# EAGLE design TuringTapeMusic_2 (EAGLE 7.6.0)
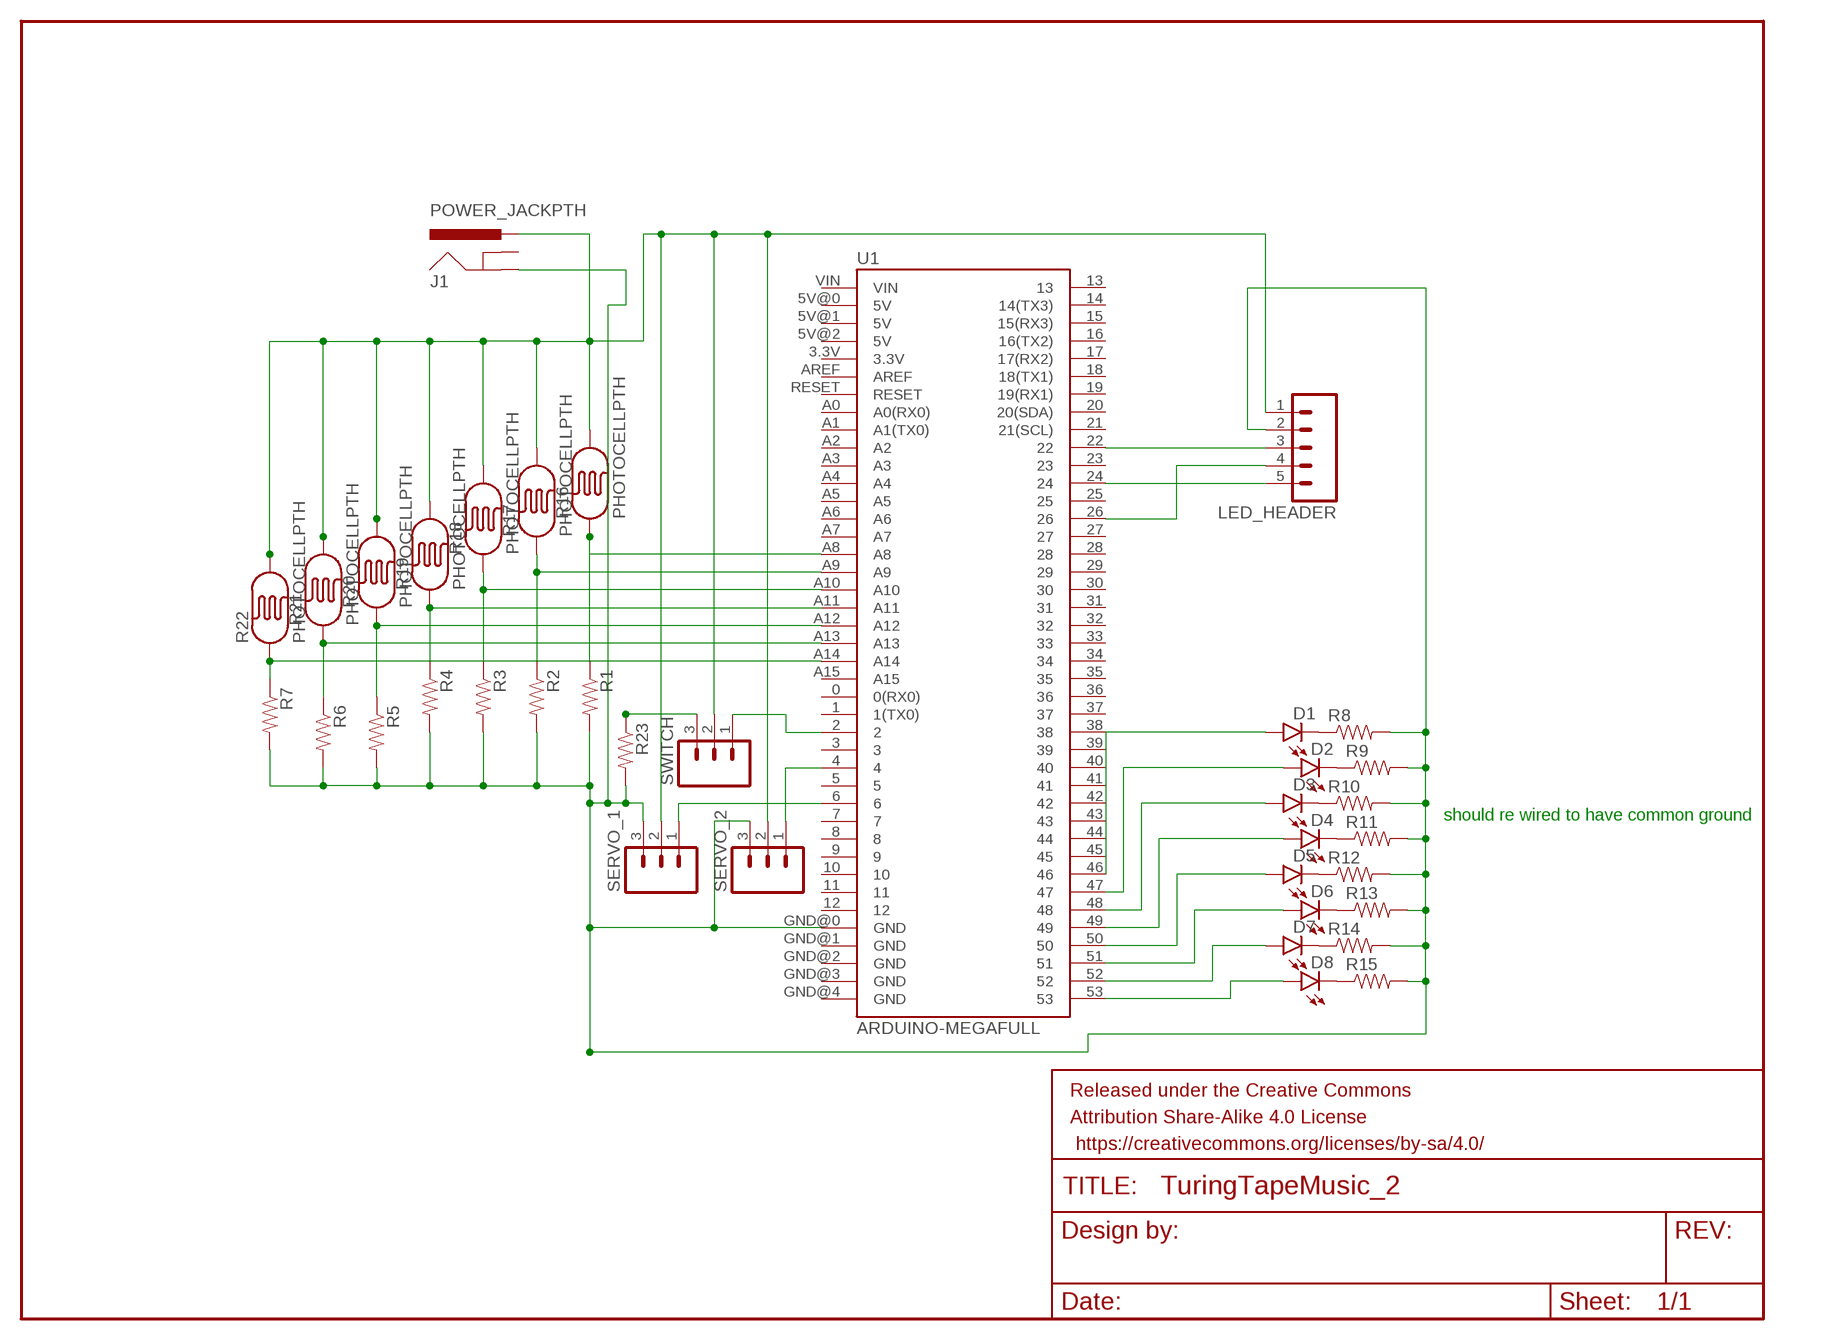
[diagram p0: schematic, sheet 1]

## Parts
D1  LED5MM  [LED5MM]
D2  LED5MM  [LED5MM]
D3  LED5MM  [LED5MM]
D4  LED5MM  [LED5MM]
D5  LED5MM  [LED5MM]
D6  LED5MM  [LED5MM]
D7  LED5MM  [LED5MM]
D8  LED5MM  [LED5MM]
FRAME1  FRAME-LETTER  [CREATIVE_COMMONS]
J1  POWER_JACKPTH  [POWER_JACK_PTH]
LED_HEADER  M05LOCK  [1X05_LOCK]
R1  RESISTORPTH-1/4W  [AXIAL-0.4]
R2  RESISTORPTH-1/4W  [AXIAL-0.4]
R3  RESISTORPTH-1/4W  [AXIAL-0.4]
R4  RESISTORPTH-1/4W  [AXIAL-0.4]
R5  RESISTORPTH-1/4W  [AXIAL-0.4]
R6  RESISTORPTH-1/4W  [AXIAL-0.4]
R7  RESISTORPTH-1/4W  [AXIAL-0.4]
R8  RESISTORPTH-1/4W  [AXIAL-0.4]
R9  RESISTORPTH-1/4W  [AXIAL-0.4]
R10  RESISTORPTH-1/4W  [AXIAL-0.4]
R11  RESISTORPTH-1/4W  [AXIAL-0.4]
R12  RESISTORPTH-1/4W  [AXIAL-0.4]
R13  RESISTORPTH-1/4W  [AXIAL-0.4]
R14  RESISTORPTH-1/4W  [AXIAL-0.4]
R15  RESISTORPTH-1/4W  [AXIAL-0.4]
R16  PHOTOCELLPTH  [PHOTOCELL]
R17  PHOTOCELLPTH  [PHOTOCELL]
R18  PHOTOCELLPTH  [PHOTOCELL]
R19  PHOTOCELLPTH  [PHOTOCELL]
R20  PHOTOCELLPTH  [PHOTOCELL]
R21  PHOTOCELLPTH  [PHOTOCELL]
R22  PHOTOCELLPTH  [PHOTOCELL]
R23  RESISTORPTH-1/4W  [AXIAL-0.4]
SERVO_1  M03LOCK  [1X03_LOCK]
SERVO_2  M03LOCK  [1X03_LOCK]
SWITCH  M03LOCK  [1X03_LOCK]
U1  ARDUINO-MEGAFULL  [ARDUINO_MEGA]

## Nets
N$1: R1.P$1 R16.1 U1.A8
N$2: R2.P$1 R17.1 U1.A9
N$3: R5.P$1 R20.1 U1.A12
N$4: R3.P$1 R18.1 U1.A10
N$5: R6.P$1 R21.1 U1.A13
N$6: R4.P$1 R19.1 U1.A11
N$7: R7.P$1 R22.1 U1.A14
N$8: D1.K(C) R8.P$1
N$9: D2.K(C) R9.P$1
N$10: D3.K(C) R10.P$1
N$11: D4.K(C) R11.P$1
N$12: D5.K(C) R12.P$1
N$13: D6.K(C) R13.P$1
N$14: D7.K(C) R14.P$1
N$15: D8.K(C) R15.P$1
N$16: D1.A U1.46
N$17: D2.A U1.47
N$18: D3.A U1.48
N$19: D4.A U1.49
N$20: D5.A U1.50
N$21: D6.A U1.51
N$22: D7.A U1.52
N$23: D8.A U1.53
N$24: LED_HEADER.5 U1.24
N$25: LED_HEADER.4 U1.26
N$26: LED_HEADER.3 U1.22
N$27: SERVO_2.1 U1.4
N$28: SERVO_1.1 U1.6
N$29: SWITCH.1 U1.2
N$30: R23.P$1 SWITCH.3
N$31: J1.GND LED_HEADER.2 R1.P$2 R2.P$2 R3.P$2 R4.P$2 R5.P$2 R6.P$2 R7.P$2 R8.P$2 R9.P$2 R10.P$2 R11.P$2 R12.P$2 R13.P$2 R14.P$2 R15.P$2 R23.P$2 SERVO_1.3 SERVO_2.3 U1.GND@0(GND)
N$32: J1.PWR LED_HEADER.1 R16.2 R17.2 R18.2 R19.2 R20.2 R21.2 R22.2 SERVO_1.2 SERVO_2.2 SWITCH.2
Unconnected: J1.GNDBREAK U1.0(0(RX0)) U1.1(1(TX0)) U1.3 U1.3.3V U1.5 U1.5V@0(5V) U1.5V@1(5V) U1.5V@2(5V) U1.7 U1.8 U1.9 U1.10 U1.11 U1.12 U1.13 U1.14(14(TX3)) U1.15(15(RX3)) U1.16(16(TX2)) U1.17(17(RX2)) U1.18(18(TX1)) U1.19(19(RX1)) U1.20(20(SDA)) U1.21(21(SCL)) U1.23 U1.25 U1.27 U1.28 U1.29 U1.30 U1.31 U1.32 U1.33 U1.34 U1.35 U1.36 U1.37 U1.38 U1.39 U1.40 U1.41 U1.42 U1.43 U1.44 U1.45 U1.A0(A0(RX0)) U1.A1(A1(TX0)) U1.A2 U1.A3 U1.A4 U1.A5 U1.A6 U1.A7 U1.A15 U1.AREF U1.GND@1(GND) U1.GND@2(GND) U1.GND@3(GND) U1.GND@4(GND) U1.RESET U1.VIN

## Notes on the sheet
- should re wired to have common ground

## Library data of the parts
D1-D8 = SparkFun-LED:LED: LEDs Standard schematic elements and footprints for 5mm, 3mm, 1206, and 0603 sized LEDs. 5mm - Spark Fun Electronics SKU : COM-00529 (and others)
FRAME1 = SparkFun-Aesthetics:FRAME-LETTER: Schematic Frame Standard 8.5x11 US Letter frame
J1 = SparkFun-Connectors:POWER_JACK: Power Jack This is the standard 5.5mm barrel jack for power. The PTH is the most common, proven, reliable, footprint. The Slot footprint only works if the mill layer is transmitted to the PCB fab house so be warned. Mating wall wart : TOL-00298 (and others); PROD_ID: CONN-08197
LED_HEADER = SparkFun-Connectors:M05: Header 5 Standard 5-pin 0.1" header. Use with straight break away headers (SKU : PRT-00116), right angle break away headers (PRT-00553), swiss pins (PRT-00743), machine pins (PRT-00117), and female headers (PRT-00115). Molex polarized connector foot print use with SKU : PRT-08230 with associated crimp pins and housings.
R1-R15 R23 = SparkFun-Passives:RESISTOR: Resistor Basic schematic elements and footprints for 0603, 1206, and PTH resistors.
R16-R22 = SparkFun-Sensors:PHOTOCELL: CdS photoresistor. This is a low cost way to detect light levels. Resistance decreases with more incoming light. SparkFun SKU: SEN-09088
SERVO_1 SERVO_2 SWITCH = SparkFun-Connectors:M03: Header 3 Standard 3-pin 0.1" header. Use with straight break away headers (SKU : PRT-00116), right angle break away headers (PRT-00553), swiss pins (PRT-00743), machine pins (PRT-00117), and female headers (PRT-00115). Molex polarized connector foot print use with SKU : PRT-08232 with associated crimp pins and housings.
U1 = SparkFun-Boards:ARDUINO-MEGA: Arduino Mega board footprint

## Board
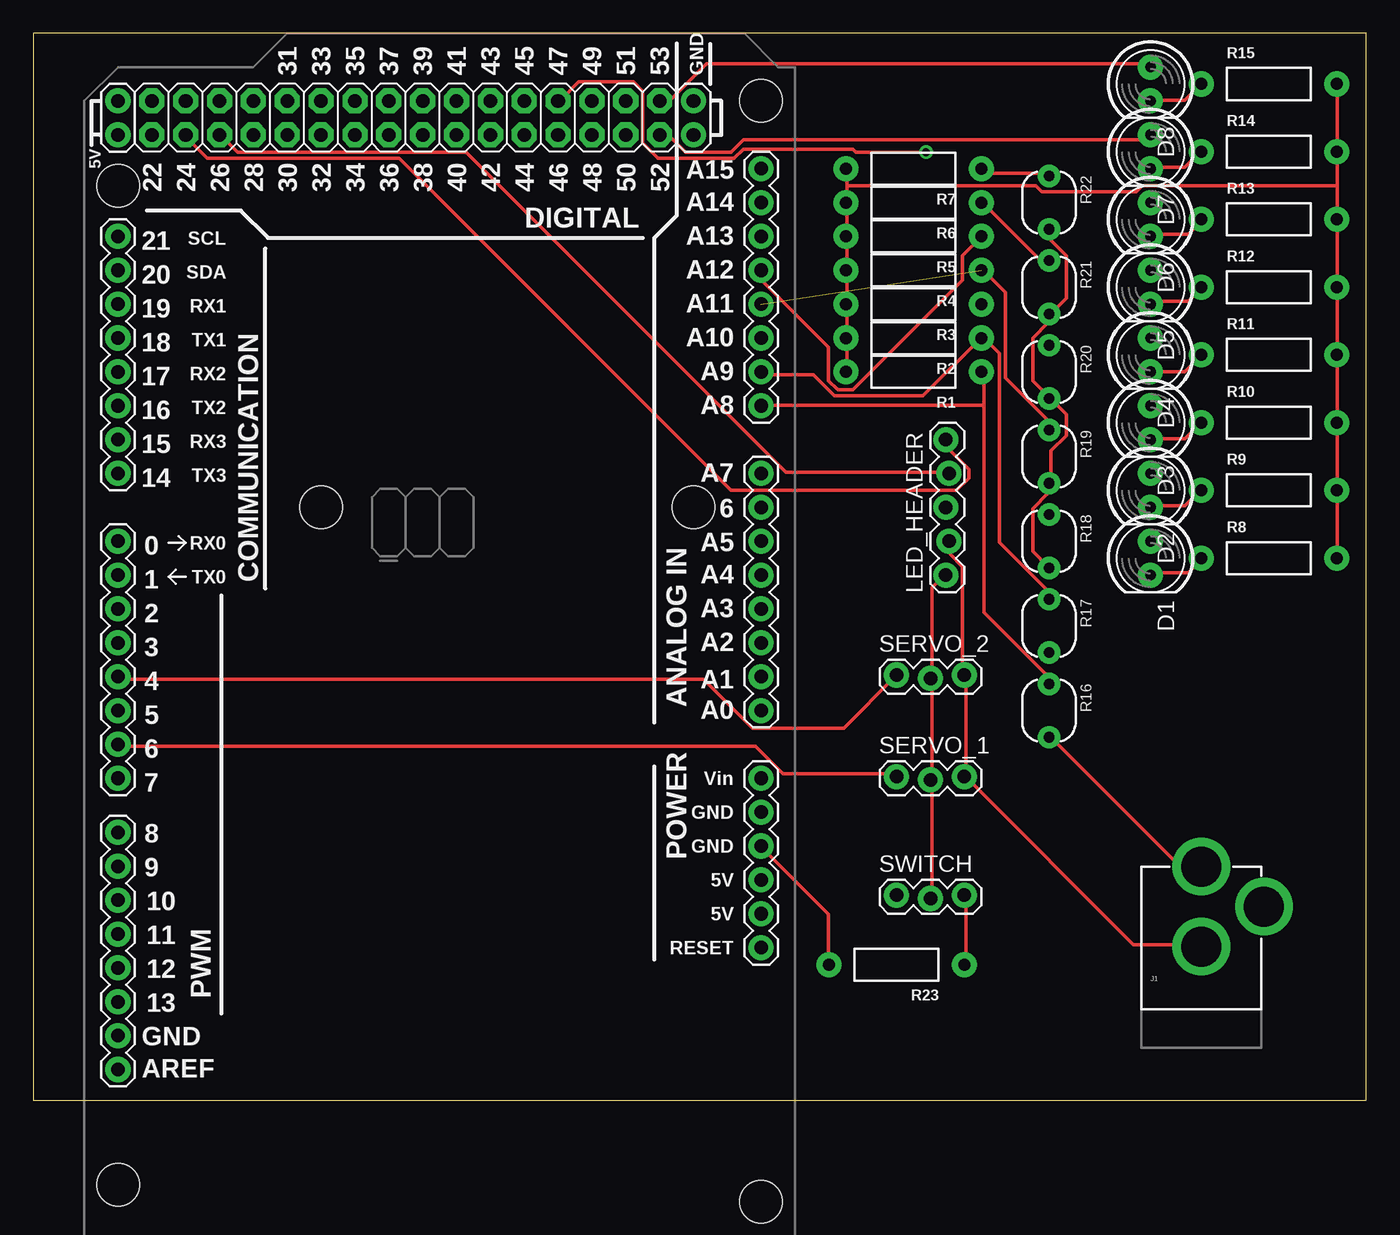
[diagram p1: board, top side]
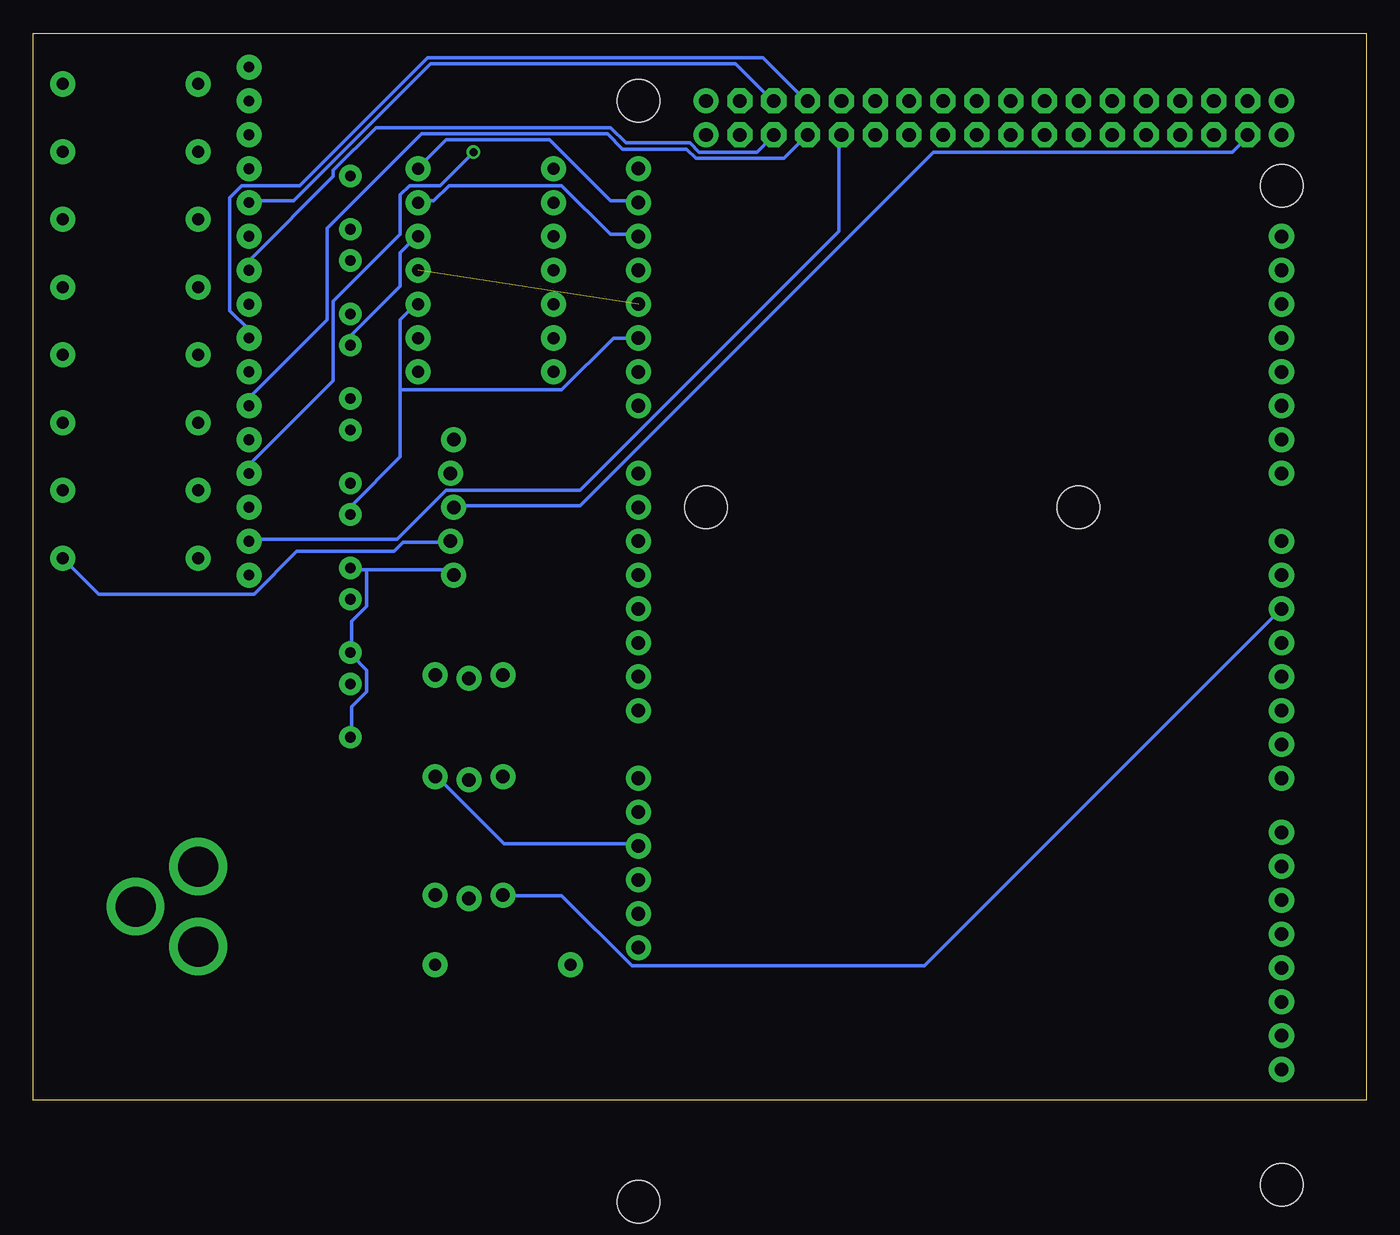
[diagram p2: board, bottom side, seen from below]

Size 100 x 80 mm. Coordinates in mm from the lower left corner, seen from the top.
Outline: 0,0 100,0 100,80 0,80 0,0
Copper layers (1*16): Top 0.035mm / dielectric 1.5mm / Bottom 0.035mm
Design rules "default": minimum track width 10mil, minimum drill 24mil, track to track 8mil, track to pad 8mil, pad to pad 8mil, via to via 8mil, smd to smd 8mil, copper to edge 40mil, drill to drill 8mil, minimum pad ring 10mil, minimum via ring 8mil, stop-mask expansion 4mil, vias tented up to drill 0mil, thermal gap 10mil

### Footprints (pad centres in the part's own frame; a part is rotated, then mirrored left to right if it is on the bottom)
LED5MM = drill 0.813 pad 1.88: A -1.27,0; K 1.27,0
POWER_JACK_PTH = drill 2.997 pad 4.318: GND 0,7.7; GNDBREAK 4.7,10.7; PWR 0,13.7
1X05_LOCK = drill 1.016 pad 1.88: 1 0,0.127; 2 2.54,-0.127; 3 5.08,0.127; 4 7.62,-0.127; 5 10.16,0.127
AXIAL-0.4 = drill 0.9 pad 1.88: P$1 -5.08,0; P$2 5.08,0
PHOTOCELL = drill 0.8 pad 1.676: 1 -2,0; 2 2,0
1X03_LOCK = drill 1.016 pad 1.88: 1 0,0.127; 2 2.54,-0.127; 3 5.08,0.127
ARDUINO_MEGA = drill 1.016 pad 1.88: 0 63.5,50.8; 1 60.96,50.8; 2 58.42,50.8; 3 55.88,50.8; 3.3V 35.56,2.54; 4 53.34,50.8; 5 50.8,50.8; 5V@0 38.1,2.54; 5V@1 93.98,50.8; 5V@2 96.52,50.8; 6 48.26,50.8; 7 45.72,50.8; 8 41.656,50.8; 9 39.116,50.8; 10 36.576,50.8; 11 34.036,50.8; 12 31.496,50.8; 13 28.956,50.8; 14 68.58,50.8; 15 71.12,50.8; 16 73.66,50.8; 17 76.2,50.8; 18 78.74,50.8; 19 81.28,50.8; 20 83.82,50.8; 21 86.36,50.8; A0 50.8,2.54; A1 53.34,2.54; A2 55.88,2.54; A3 58.42,2.54; A4 60.96,2.54; A5 63.5,2.54; A6 66.04,2.54; A7 68.58,2.54; A8 73.66,2.54; A9 76.2,2.54; A10 78.74,2.54; A11 81.28,2.54; A12 83.82,2.54; A13 86.36,2.54; A14 88.9,2.54; A15 91.44,2.54; AREF 23.876,50.8; GND@0 40.64,2.54; GND@1 43.18,2.54; GND@2 93.98,7.62; GND@3 96.52,7.62; GND@4 26.416,50.8; RESET 33.02,2.54; VIN 45.72,2.54 | drill 1.016 pad 1.88 octagon: 22 93.98,48.26; 23 96.52,48.26; 24 93.98,45.72; 25 96.52,45.72; 26 93.98,43.18; 27 96.52,43.18; 28 93.98,40.64; 29 96.52,40.64; 30 93.98,38.1; 31 96.52,38.1; 32 93.98,35.56; 33 96.52,35.56; 34 93.98,33.02; 35 96.52,33.02; 36 93.98,30.48; 37 96.52,30.48; 38 93.98,27.94; 39 96.52,27.94; 40 93.98,25.4; 41 96.52,25.4; 42 93.98,22.86; 43 96.52,22.86; 44 93.98,20.32; 45 96.52,20.32; 46 93.98,17.78; 47 96.52,17.78; 48 93.98,15.24; 49 96.52,15.24; 50 93.98,12.7; 51 96.52,12.7; 52 93.98,10.16; 53 96.52,10.16 | hole 3.2: 15.24,50.8; 13.97,2.54; 66.04,35.56; 66.04,7.62; 90.17,50.8; 96.52,2.54

### Placement (x,y rotation side)
D1  83.82,40.64 270 top
D2  83.82,45.72 270 top
D3  83.82,50.8 270 top
D4  83.82,55.88 270 top
D5  83.82,60.96 270 top
D6  83.82,66.04 270 top
D7  83.82,71.12 270 top
D8  83.82,76.2 270 top
FRAME1  15.24,-43.18 0 top  (outside the outline)
J1  87.63,3.81 0 top
LED_HEADER  68.58,39.37 90 top
R1  66.04,54.61 180 top
R2  66.04,57.15 180 top
R3  66.04,59.69 180 top
R4  66.04,62.23 180 top
R5  66.04,64.77 180 top
R6  66.04,67.31 180 top
R7  66.04,69.85 180 top
R8  92.71,40.64 0 top
R9  92.71,45.72 0 top
R10  92.71,50.8 0 top
R11  92.71,55.88 0 top
R12  92.71,60.96 0 top
R13  92.71,66.04 0 top
R14  92.71,71.12 0 top
R15  92.71,76.2 0 top
R16  76.2,29.21 270 top
R17  76.2,35.56 270 top
R18  76.2,41.91 270 top
R19  76.2,48.26 270 top
R20  76.2,54.61 270 top
R21  76.2,60.96 270 top
R22  76.2,67.31 270 top
R23  64.77,10.16 180 top
SERVO_1  64.77,24.13 0 top
SERVO_2  64.77,31.75 0 top
SWITCH  64.77,15.24 0 top
U1  57.15,-21.59 90 top

### Tracks (layer width: path | path; a pad name or v marks a point on that pad's centre or on a via)
N$1
  Top 0.254: 71.32,52.12 71.32,54.41 R1.P$1 | 71.32,52.12 71.32,36.58 76.12,31.77 76.12,31.32 R16.1 | 71.32,52.12 54.63,52.12 U1.A8
N$2
  Top 0.254: R17.1 76.12,37.72 76.12,38.18 72.47,41.83 72.47,56.01 71.32,57.15 R2.P$1 71.09,57.15 66.75,52.81 60.12,52.81 58.52,54.41 54.63,54.41 U1.A9
N$3
  Top 0.254: U1.A12 54.63,62.18 54.63,61.49 59.66,56.46 59.66,53.95 60.35,53.26 61.49,53.26 69.72,61.49 69.72,63.32 71.09,64.69 R5.P$1
  Bottom 0.254: R20.1 76.12,56.69 76.12,57.38 72.47,61.04 72.47,63.55 71.32,64.69 R5.P$1
N$4
  Bottom 0.254: 72.47,53.26 72.47,58.52 71.32,59.66 R3.P$1 | 72.47,53.26 72.47,48.23 76.12,44.58 76.12,44.12 R18.1 | U1.A10 56.46,57.15 60.35,53.26 72.47,53.26
N$5
  Top 0.254: R21.1 76.12,63.09 75.44,63.09 71.32,67.21 R6.P$1
  Bottom 0.254: U1.A13 54.63,64.92 56.69,64.92 60.35,68.58 68.81,68.58 69.95,67.44 71.09,67.44 R6.P$1
N$6  (1 unrouted)
  Top 0.254: R19.1 76.12,50.29 76.12,50.98 72.92,54.18 72.92,60.58 71.32,62.18 R4.P$1
N$7
  Top 0.254: R22.1 76.12,69.49 71.55,69.49 71.32,69.72 R7.P$1
  Bottom 0.254: U1.A14 54.63,67.44 56.69,67.44 61.27,72.01 69.04,72.01 71.09,69.95 R7.P$1
N$8
  Top 0.254: D1.K 83.9,39.55 86.64,39.55 87.55,40.46 R8.P$1
N$9
  Top 0.254: D2.K 83.9,44.58 86.41,44.58 87.55,45.72 R9.P$1
N$10
  Top 0.254: D3.K 83.9,49.61 86.41,49.61 87.55,50.75 R10.P$1
N$11
  Top 0.254: D4.K 83.9,54.63 86.41,54.63 87.55,55.78 R11.P$1
N$12
  Top 0.254: D5.K 83.9,59.89 86.64,59.89 87.55,60.81 R12.P$1
N$13
  Top 0.254: D6.K 83.9,64.92 86.64,64.92 87.55,65.84 R13.P$1
N$14
  Top 0.254: D7.K 83.9,69.95 86.41,69.95 87.55,71.09 R14.P$1
N$15
  Top 0.254: R15.P$1 86.41,74.98 83.9,74.98 D8.K
N$16
  Bottom 0.254: D1.A 83.67,42.06 72.69,42.06 69.04,45.72 58.98,45.72 39.55,65.15 39.55,72.24 U1.46
N$17  (via drill 0.61)
  Top 0.254: v66.98,71.09 61.72,71.09 61.49,71.32 53.26,71.32 52.58,70.64 46.86,70.64 45.72,71.78 45.72,75.67 45.03,76.35 40.92,76.35 39.55,74.98 U1.47
  Bottom 0.254: v66.98,71.09 69.49,68.58 71.78,68.58 72.47,67.89 72.47,64.92 77.5,59.89 77.5,53.95 83.67,47.78 83.67,47.09 D2.A
N$18
  Bottom 0.254: U1.48 43.66,70.64 50.29,70.64 50.98,71.32 55.78,71.32 56.92,72.47 70.87,72.47 77.95,65.38 77.95,58.52 83.67,52.81 83.67,52.12 D3.A
N$19
  Bottom 0.254: D4.A 83.9,57.15 83.9,57.84 85.27,59.21 85.27,67.67 84.35,68.58 80.01,68.58 70.41,78.18 45.26,78.18 42.06,74.98 U1.49
N$20
  Bottom 0.254: D5.A 83.67,62.41 83.67,63.09 77.5,69.27 77.5,69.72 74.3,72.92 56.69,72.92 55.55,71.78 50.75,71.78 50.06,71.09 45.72,71.09 44.58,72.24 U1.50
N$21
  Bottom 0.254: D6.A 83.67,67.44 80.47,67.44 70.18,77.72 47.32,77.72 44.58,74.98 U1.51
N$22
  Top 0.254: D7.A 83.44,72.01 53.26,72.01 52.35,71.09 48.92,71.09 47.78,72.24 47.09,72.24 U1.52
N$23
  Top 0.254: U1.53 47.09,74.98 47.78,74.98 50.52,77.72 83.44,77.72 83.67,77.5 D8.A
N$24
  Top 0.254: LED_HEADER.5 68.58,49.38 68.58,48.92 70.18,47.32 70.18,46.63 69.27,45.72 52.35,45.72 27.43,70.64 13.03,70.64 11.43,72.24 U1.24
N$25
  Top 0.254: LED_HEADER.4 68.58,47.09 56.46,47.09 32.46,71.09 15.32,71.09 14.17,72.24 U1.26
N$26
  Bottom 0.254: LED_HEADER.3 68.35,44.58 58.98,44.58 32.46,71.09 10.06,71.09 8.91,72.24 U1.22
N$27
  Top 0.254: U1.4 6.4,31.55 50.29,31.55 53.95,27.89 60.81,27.89 64.69,31.77 SERVO_2.1
N$28
  Top 0.254: SERVO_1.1 64.69,24.46 56.24,24.46 54.18,26.52 6.4,26.52 U1.6
N$29
  Bottom 0.254: SWITCH.1 64.69,15.32 60.35,15.32 55.09,10.06 33.15,10.06 6.4,36.8 U1.2
N$30
  Top 0.254: R23.P$1 69.95,10.29 69.95,15.32 SWITCH.3
N$31
  Top 0.254: R23.P$2 59.66,10.29 59.66,13.95 54.63,18.97 U1.GND@0 | LED_HEADER.2 68.81,41.83 68.81,40.92 69.72,40.01 69.72,32 SERVO_2.3 69.95,31.77 69.95,24.46 SERVO_1.3 69.95,24.23 82.53,11.66 87.55,11.66 J1.GND | 61.04,68.58 61.04,67.44 R6.P$2 61.04,67.21 61.04,64.92 R5.P$2 61.04,64.69 61.04,62.41 R4.P$2 61.04,62.18 61.04,59.89 R3.P$2 61.04,59.66 61.04,57.15 | 61.04,68.58 61.04,69.72 R7.P$2 | 61.04,57.15 61.04,54.63 R1.P$2 | 61.04,57.15 R2.P$2 | R15.P$2 97.84,76.12 97.84,71.32 R14.P$2 97.84,71.09 97.84,68.58 | 97.84,45.72 97.84,40.69 R8.P$2 | 97.84,45.72 97.84,50.75 R10.P$2 97.84,50.98 97.84,55.78 R11.P$2 97.84,56.01 97.84,60.81 R12.P$2 97.84,61.04 97.84,65.84 R13.P$2 97.84,66.06 97.84,68.58 | 97.84,45.72 R9.P$2 | 61.04,68.58 75.21,68.58 75.67,68.12 82.75,68.12 83.21,68.58 97.84,68.58
  Bottom 0.254: U1.GND@0 54.63,19.2 64.69,19.2 69.72,24.23 SERVO_1.3 | R8.P$2 95.1,37.95 83.44,37.95 80.24,41.15 72.92,41.15 72.24,41.83 68.81,41.83 LED_HEADER.2
N$32
  Top 0.254: R22.2 76.35,65.15 76.35,64.47 77.5,63.32 77.5,60.12 76.35,58.98 R21.2 76.12,58.75 76.12,58.29 74.98,57.15 74.98,53.95 76.12,52.81 R20.2 76.35,52.58 77.5,51.44 77.5,49.84 76.35,48.69 76.35,46.41 R19.2 76.12,46.18 76.12,45.49 74.98,44.35 74.98,41.15 76.12,40.01 R18.2 | 67.44,24 67.44,15.32 SWITCH.2 | 67.44,24 67.44,31.55 SERVO_2.2 67.44,31.77 67.44,38.41 68.35,39.32 LED_HEADER.1 | 67.44,24 SERVO_1.2 | J1.PWR 87.55,17.6 85.95,17.6 76.35,27.2 R16.2
  Bottom 0.254: R16.2 76.12,27.43 76.12,29.49 74.98,30.63 74.98,32.23 76.12,33.38 R17.2 76.12,33.6 76.12,35.89 74.98,37.03 74.98,39.78 | 74.98,39.78 68.81,39.78 68.58,39.55 LED_HEADER.1 | 74.98,39.78 76.12,39.78 R18.2